# EAGLE schematic Vector_Board_Schematic_v12 (EAGLE 9.7.0)
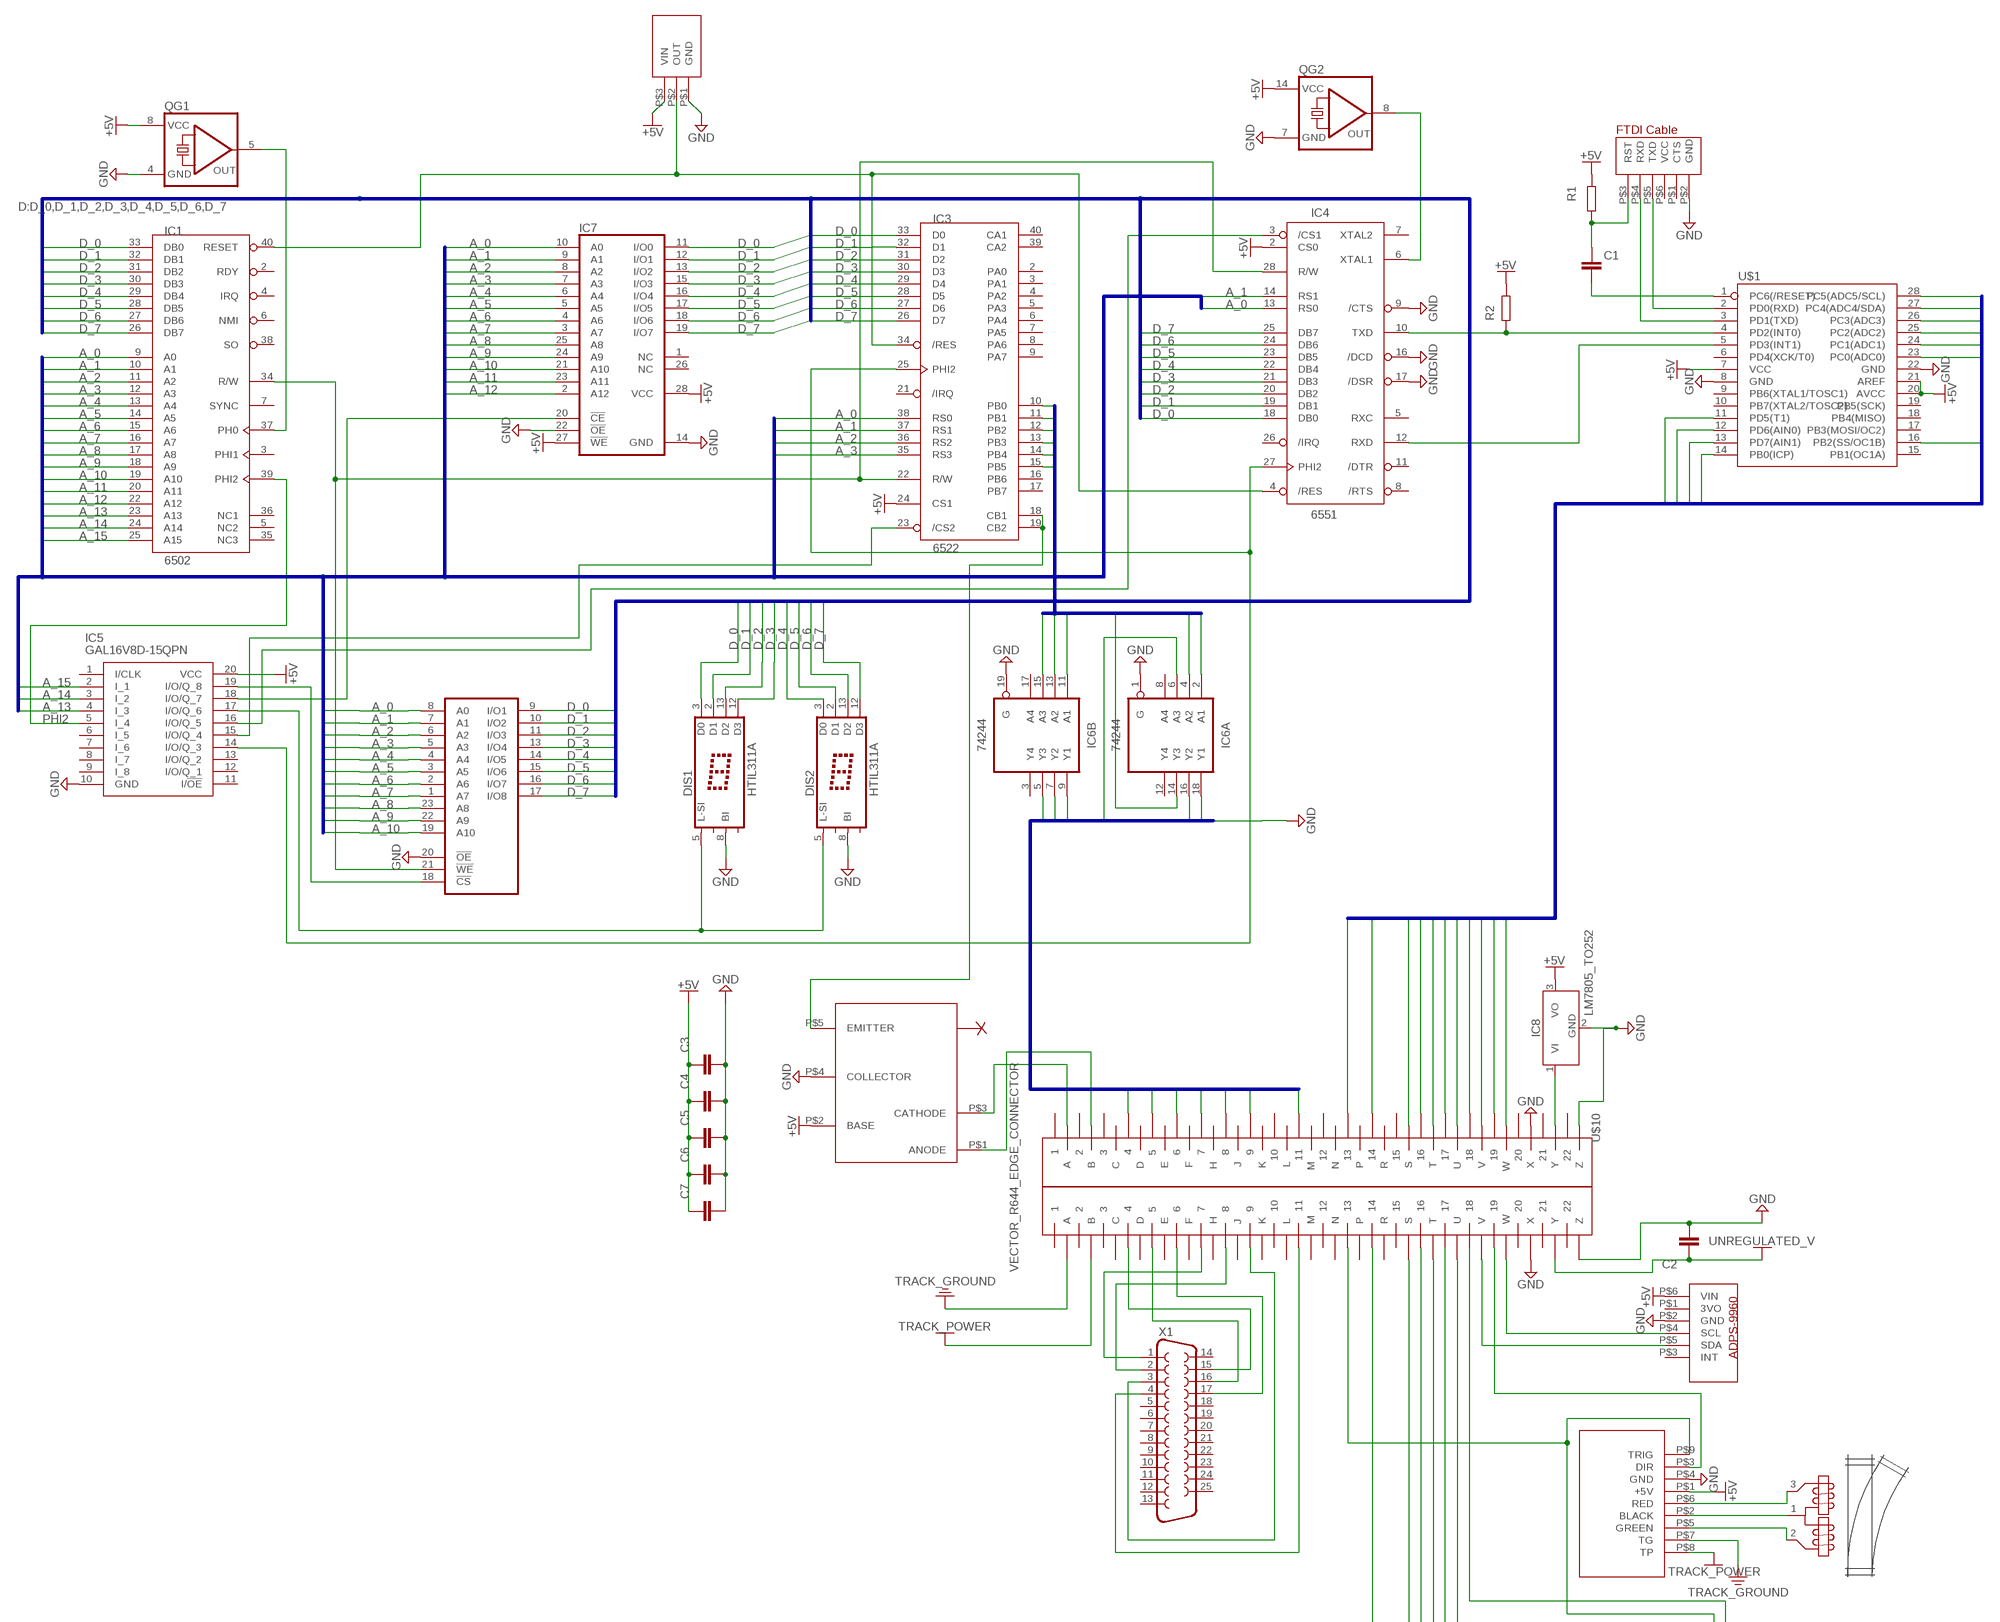
[diagram p0: schematic, sheet 1, part 1 of 2]
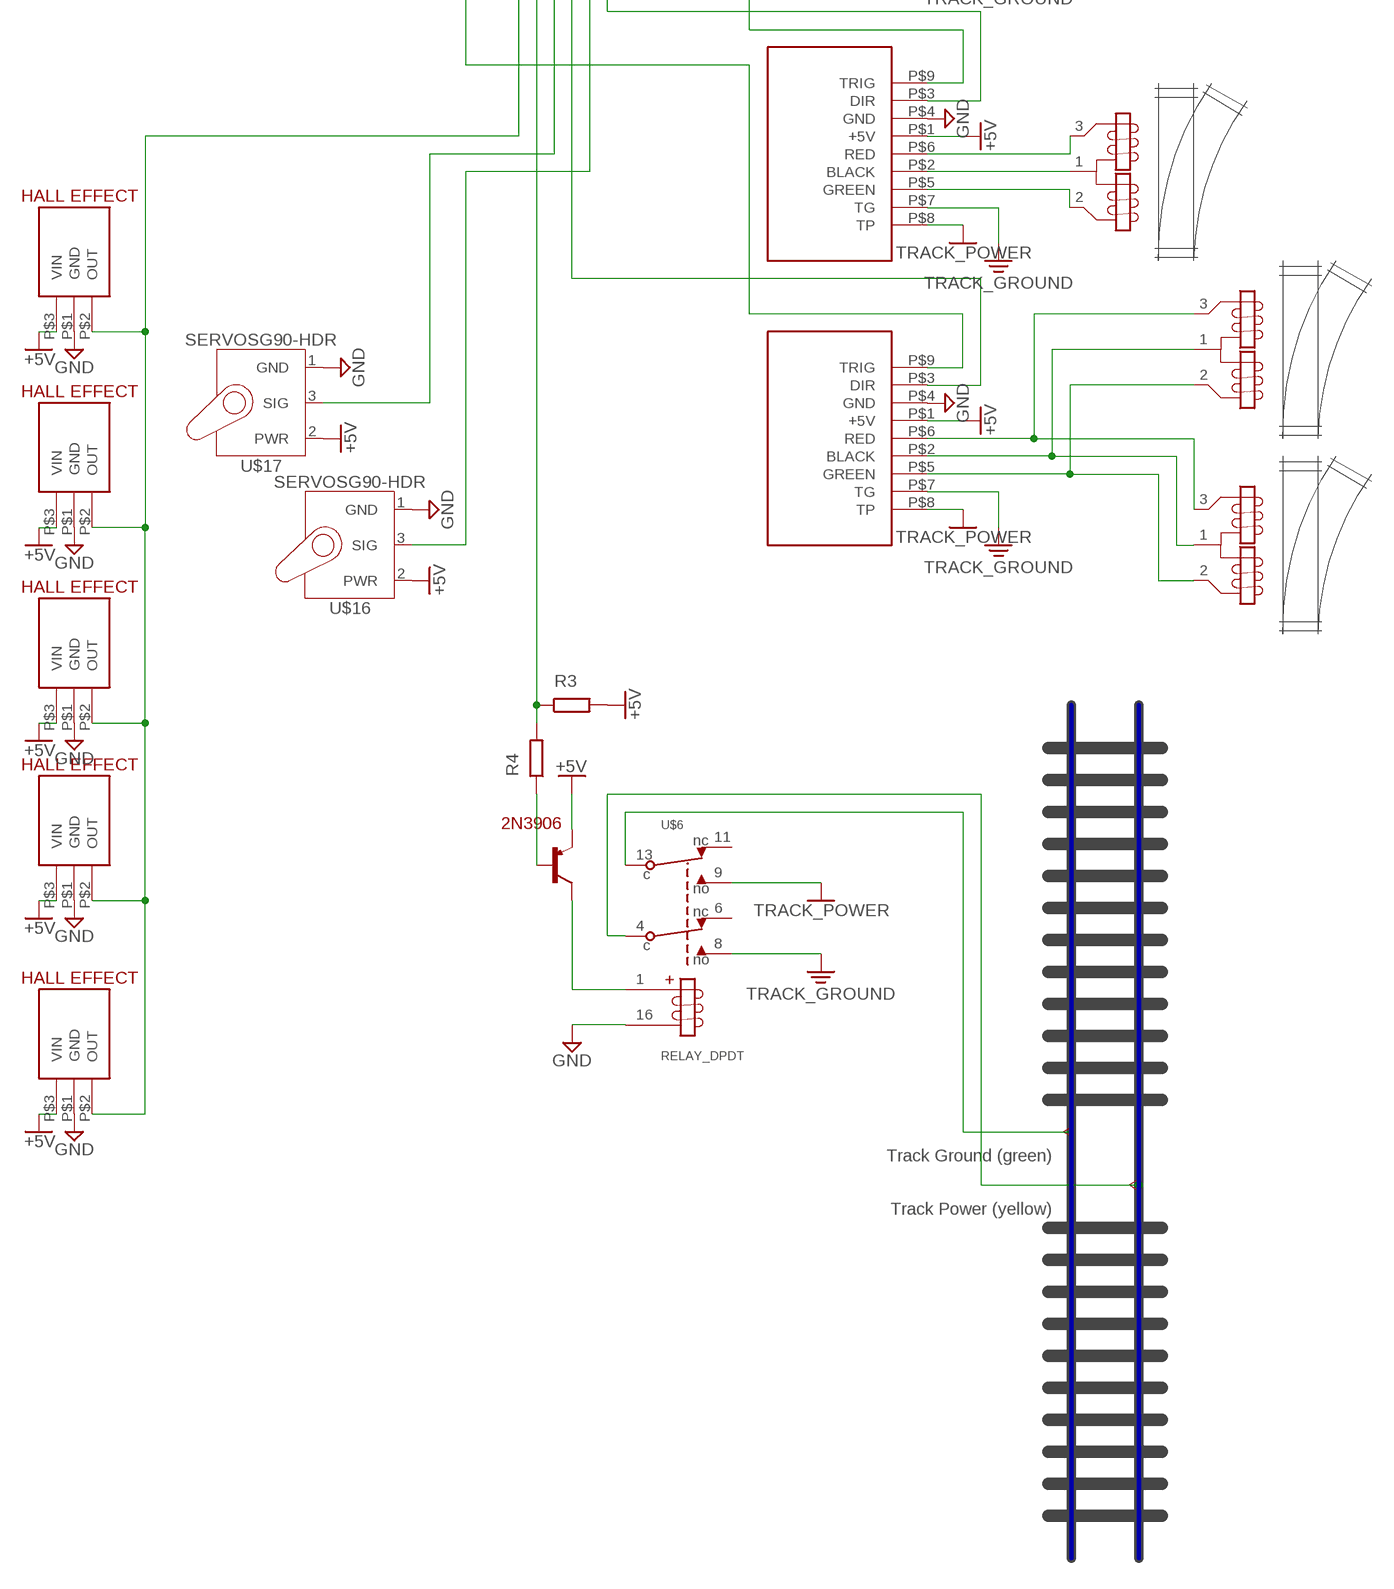
[diagram p1: schematic, sheet 1, part 2 of 2]

## Parts
C1  C  (no package)
C2  C  (no package)
C3  C  (no package)
C4  C  (no package)
C5  C  (no package)
C6  C  (no package)
C7  C  (no package)
DIS1  HTIL311A  [HTIL311A]
DIS2  HTIL311A  [HTIL311A]
IC1  6502  [DIP40]
IC2  6116P  [DIL24-6]
IC3  6522  [DIP40]
IC4  6551  [DIP28]
IC5  GAL16V8D-15QPN  [DIP794W56P254L2591H533Q20N]
IC6  74244  74LS244DW  [SO20W]
IC7  28C64C  [DIL28-6]
IC8  LM7805_TO252  [TO252]
OPTOISOLATOR  OPTO  [OPTO]
QG1  QG5460  [DIL08S]
QG2  QG5860  [DIL14S]
R1  R  (no package)
R2  R  (no package)
R3  R  (no package)
R4  R  (no package)
T1  2N2222  [TO92-EBC-OVAL]
U$1  ATMEGA328-DIP  [DIP28]
U$2  CONNECTOR-REVERSE  [CONNTECTOR-REVERSE]
U$3  FTDI-CABLE  [FTDI-CABLE]
U$4  POWERON-RESET  [RESET]
U$6  RELAY_DPDT  [DIP16_RELAY]
U$7  ADPS-9960  [ADPS-9960]
U$8  ATLASCODE80TRACK  [ATLASCODE80TRACK]
U$9  RR_REMOTE_TURNOUT  [W237-103]
U$10  VECTOR_R644_EDGE_CONNECTOR  [VECTOR44]
U$11  HALL-EFFECT  [HALL-EFFECT]
U$12  HALL-EFFECT  [HALL-EFFECT]
U$13  HALL-EFFECT  [HALL-EFFECT]
U$14  HALL-EFFECT  [HALL-EFFECT]
U$15  HALL-EFFECT  [HALL-EFFECT]
U$16  SERVOSG90-HDR  [1X03]
U$17  SERVOSG90-HDR  [1X03]
U$24  RR_REMOTE_TURNOUT  [W237-103]
U$25  RR_REMOTE_TURNOUT  [W237-103]
U$26  RR_REMOTE_TURNOUT  [W237-103]
U$27  TRICKLE-CHARGE  [TRICKLE-CHARGE]
U$28  TRICKLE-CHARGE  [TRICKLE-CHARGE]
U$29  TRICKLE-CHARGE  [TRICKLE-CHARGE]
X1  F25H  [F25H]

## Nets
4: U$10.P$4 ; supply symbol labelled GND
5: IC6.18(A:Y1) U$10.P$5
6: IC6.16(A:Y2) U$10.P$6
7: IC6.6(A:A3) U$10.P$7
8: IC6.9(B:Y1) U$10.P$8
9: IC6.5(B:Y3) U$10.P$9
11: IC6.7(B:Y2) U$10.P$11
+5V: IC3.24(CS1) IC4.2(CS0) IC5.20(VCC) IC7.27(!WE) IC7.28(VCC) IC8.3(VO) OPTOISOLATOR.P$2(BASE) QG1.8(VCC) QG2.14(VCC) R1.1 R2.2 R3.2 T1.C U$1.7(VCC) U$1.20(AVCC) U$1.21(AREF) U$4.P$3(VIN) U$7.P$6(VIN) U$11.P$3(VIN) U$12.P$3(VIN) U$13.P$3(VIN) U$14.P$3(VIN) U$15.P$3(VIN) U$16.2(PWR) U$17.2(PWR) U$27.P$1(+5V) U$28.P$1(+5V) U$29.P$1(+5V)
A0: U$1.23(PC0(ADC0)) U$10.P$17
A1: U$1.24(PC1(ADC1)) U$10.P$18
A2: U$1.25(PC2(ADC2)) U$10.P$19
A3: U$1.26(PC3(ADC3)) U$10.P$16
A4: U$1.27(PC4(ADC4/SDA)) U$10.P$V(V)
A5: U$1.28(PC5(ADC5/SCL)) U$10.P$W(W)
A_0: IC1.9(A0) IC2.8(A0) IC3.38(RS0) IC4.13(RS0) IC7.10(A0)
A_1: IC1.10(A1) IC2.7(A1) IC3.37(RS1) IC4.14(RS1) IC7.9(A1)
A_2: IC1.11(A2) IC2.6(A2) IC3.36(RS2) IC7.8(A2)
A_3: IC1.12(A3) IC2.5(A3) IC3.35(RS3) IC7.7(A3)
A_4: IC1.13(A4) IC2.4(A4) IC7.6(A4)
A_5: IC1.14(A5) IC2.3(A5) IC7.5(A5)
A_6: IC1.15(A6) IC2.2(A6) IC7.4(A6)
A_7: IC1.16(A7) IC2.1(A7) IC7.3(A7)
A_8: IC1.17(A8) IC2.23(A8) IC7.25(A8)
A_9: IC1.18(A9) IC2.22(A9) IC7.24(A9)
A_10: IC1.19(A10) IC2.19(A10) IC7.21(A10)
A_11: IC1.20(A11) IC7.23(A11)
A_12: IC1.22(A12) IC7.2(A12)
A_13: IC1.23(A13) IC5.4(I_3)
A_14: IC1.24(A14) IC5.3(I_2)
A_15: IC1.25(A15) IC5.2(I_1)
D5: U$1.11(PD5(T1)) U$10.P$U(U)
D6: U$1.12(PD6(AIN0)) U$10.P$T(T)
D7: U$1.13(PD7(AIN1)) U$10.P$13
D8: U$1.14(PB0(ICP)) U$10.P$14
D10: U$1.16(PB2(SS/OC1B)) U$10.P$S(S)
D_0: DIS1.3(D0) IC1.33(DB0) IC2.9(I/O1) IC3.33(D0) IC4.18(DB0) IC7.11(I/O0)
D_1: DIS1.2(D1) IC1.32(DB1) IC2.10(I/O2) IC3.32(D1) IC4.19(DB1) IC7.12(I/O1)
D_2: DIS1.13(D2) IC1.31(DB2) IC2.11(I/O3) IC3.31(D2) IC4.20(DB2) IC7.13(I/O2)
D_3: DIS1.12(D3) IC1.30(DB3) IC2.13(I/O4) IC3.30(D3) IC4.21(DB3) IC7.15(I/O3)
D_4: DIS2.3(D0) IC1.29(DB4) IC2.14(I/O5) IC3.29(D4) IC4.22(DB4) IC7.16(I/O4)
D_5: DIS2.2(D1) IC1.28(DB5) IC2.15(I/O6) IC3.28(D5) IC4.23(DB5) IC7.17(I/O5)
D_6: DIS2.13(D2) IC1.27(DB6) IC2.16(I/O7) IC3.27(D6) IC4.24(DB6) IC7.18(I/O6)
D_7: DIS2.12(D3) IC1.26(DB7) IC2.17(I/O8) IC3.26(D7) IC4.25(DB7) IC7.19(I/O7)
GND: C2.2 DIS1.8(BI) DIS2.8(BI) IC2.20(!OE) IC4.9(/CTS) IC4.16(/DCD) IC4.17(/DSR) IC5.10(GND) IC6.1(A:G) IC6.19(B:G) IC7.14(GND) IC7.22(!OE) IC8.2(GND) OPTOISOLATOR.P$4(COLLECTOR) QG1.4(GND) QG2.7(GND) U$1.8(GND) U$1.22(GND) U$2.P$36(X) U$2.P$38(Z) U$3.P$2(GND) U$4.P$1(GND) U$6.16 U$7.P$2(GND) U$10.P$X(X) U$10.P$Z(Z) U$11.P$1(GND) U$12.P$1(GND) U$13.P$1(GND) U$14.P$1(GND) U$15.P$1(GND) U$16.1(GND) U$17.1(GND) U$27.P$4(GND) U$28.P$4(GND) U$29.P$4(GND)
N$1: IC1.37(PH0) QG1.5(OUT)
N$2: IC4.6(XTAL1) QG2.8(OUT)
N$3: IC4.3(/CS1) IC5.16(I/O/Q_5)
N$4: IC2.18(!CS) IC5.19(I/O/Q_8)
N$5: IC5.18(I/O/Q_7) IC7.20(!CE)
N$6: DIS1.5(L-SI) DIS2.5(L-SI) IC5.17(I/O/Q_6)
N$7: IC3.23(/CS2) IC5.15(I/O/Q_4)
N$8: IC3.25(PHI2) IC4.27(PHI2) IC5.14(I/O/Q_3)
N$9: U$2.P$4 X1.15
N$10: U$2.P$6 X1.17
N$11: IC1.34(R/W) IC2.21(!WE) IC3.22(R/W) IC4.28(R/W)
N$12: U$2.P$5 X1.16
N$13: U$2.P$7 X1.1
N$14: IC4.10(TXD) R2.1 U$1.4(PD2(INT0))
N$15: IC4.12(RXD) U$1.5(PD3(INT1))
N$16: C1.2 U$1.1(PC6(/RESET))
N$17: C1.1 R1.2 U$3.P$3(RST)
N$18: U$1.3(PD1(TXD)) U$3.P$4(RXD)
N$19: U$1.2(PD0(RXD)) U$3.P$5(TXD)
N$20: U$2.P$33(U) U$16.3(SIG)
N$21: U$2.P$32(T) U$17.3(SIG)
N$22: U$2.P$14 U$29.P$9(TRIG)
N$23: U$2.P$13 U$27.P$9(TRIG) U$28.P$9(TRIG)
N$24: OPTOISOLATOR.P$1(ANODE) U$10.P$B(B)
N$25: OPTOISOLATOR.P$3(CATHODE) U$10.P$A(A)
N$26: U$2.P$31(S) U$11.P$2(OUT) U$12.P$2(OUT) U$13.P$2(OUT) U$14.P$2(OUT) U$15.P$2(OUT)
N$27: IC3.18(CB1) IC3.19(CB2) OPTOISOLATOR.P$5(EMITTER)
N$28: C3.2 C4.2 C5.2 C6.2 C7.2 ; supply symbol labelled GND
N$29: C3.1 C4.1 C5.1 C6.1 C7.1 ; supply symbol labelled +5V
N$30: IC1.40(RESET) IC3.34(/RES) IC4.4(/RES) U$4.P$2(OUT)
N$41: R4.1 T1.B
N$42: T1.E U$6.1
N$43: U$6.P2 U$8.P$2
N$44: U$2.P$8 X1.2
N$45: U$2.P$9 X1.3
N$46: U$2.P$11 X1.4
N$48: IC8.1(VI) U$10.P$Y(Y)
N$51: U$2.P$35(W) U$7.P$4(SCL)
N$52: U$2.P$34(V) U$7.P$5(SDA)
N$53: U$2.P$19 U$27.P$3(DIR)
N$54: R3.1 R4.2 U$2.P$16
N$55: U$6.P1 U$8.P$1
N$57: U$2.P$18 U$28.P$3(DIR)
N$58: U$2.P$17 U$29.P$3(DIR)
N$59: U$9.1 U$27.P$2(BLACK)
N$60: U$9.3 U$27.P$6(RED)
N$61: U$9.2 U$27.P$5(GREEN)
N$62: U$24.3 U$28.P$6(RED)
N$63: U$24.1 U$28.P$2(BLACK)
N$64: U$24.2 U$28.P$5(GREEN)
N$65: U$25.3 U$26.3 U$29.P$6(RED)
N$66: U$25.1 U$26.1 U$29.P$2(BLACK)
N$67: U$25.2 U$26.2 U$29.P$5(GREEN)
PB0: IC3.10(PB0) IC6.2(A:A1)
PB1: IC3.11(PB1) IC6.4(A:A2)
PB2: IC3.12(PB2) IC6.14(A:Y3)
PB3: IC3.13(PB3) IC6.11(B:A1)
PB4: IC3.14(PB4) IC6.13(B:A2)
PB5: IC3.15(PB5) IC6.15(B:A3)
PHI2: IC1.39(PHI2) IC5.5(I_4)
TRACK_GROUND: U$2.P$23(A) U$6.S1 U$27.P$7(TG) U$28.P$7(TG) U$29.P$7(TG)
TRACK_POWER: U$2.P$24(B) U$6.S2 U$27.P$8(TP) U$28.P$8(TP) U$29.P$8(TP)
UNREGULATED_V: C2.1 U$2.P$37(Y)
Unconnected: DIS1.1(LEDSUP) DIS2.1(LEDSUP) IC1.2(RDY) IC1.3(PHI1) IC1.4(IRQ) IC1.5(NC2) IC1.6(NMI) IC1.7(SYNC) IC1.35(NC3) IC1.36(NC1) IC1.38(SO) IC3.2(PA0) IC3.3(PA1) IC3.4(PA2) IC3.5(PA3) IC3.6(PA4) IC3.7(PA5) IC3.8(PA6) IC3.9(PA7) IC3.16(PB6) IC3.17(PB7) IC3.21(/IRQ) IC3.39(CA2) IC3.40(CA1) IC4.5(RXC) IC4.7(XTAL2) IC4.8(/RTS) IC4.11(/DTR) IC4.26(/IRQ) IC5.1(I/CLK) IC5.6(I_5) IC5.7(I_6) IC5.8(I_7) IC5.9(I_8) IC5.11(I/!OE) IC5.12(I/O/Q_1) IC5.13(I/O/Q_2) IC6.3(B:Y4) IC6.8(A:A4) IC6.12(A:Y4) IC6.17(B:A4) IC7.1(NC) IC7.26(NC) U$1.6(PD4(XCK/T0)) U$1.9(PB6(XTAL1/TOSC1)) U$1.10(PB7(XTAL2/TOSC2)) U$1.15(PB1(OC1A)) U$1.17(PB3(MOSI/OC2)) U$1.18(PB4(MISO)) U$1.19(PB5(SCK)) U$2.P$1 U$2.P$2 U$2.P$3 U$2.P$10 U$2.P$12 U$2.P$15 U$2.P$20 U$2.P$21 U$2.P$22 U$2.P$25(C) U$2.P$26(D) U$2.P$27(M) U$2.P$28(N) U$2.P$29(P) U$2.P$30(R) U$2.P$39(L) U$2.P$40(K) U$2.P$41(J) U$2.P$42(H) U$2.P$43(F) U$2.P$44(E) U$3.P$1(CTS) U$3.P$6(VCC) U$6.O1 U$6.O2 U$7.P$1(3VO) U$7.P$3(INT) U$10.P$1 U$10.P$2 U$10.P$3 U$10.P$10 U$10.P$12 U$10.P$15 U$10.P$20 U$10.P$21 U$10.P$22 U$10.P$C(C) U$10.P$D(D) U$10.P$E(E) U$10.P$F(F) U$10.P$H(H) U$10.P$J(J) U$10.P$K(K) U$10.P$L(L) U$10.P$M(M) U$10.P$N(N) U$10.P$P(P) U$10.P$R(R) X1.5 X1.6 X1.7 X1.8 X1.9 X1.10 X1.11 X1.12 X1.13 X1.14 X1.18 X1.19 X1.20 X1.21 X1.22 X1.23 X1.24 X1.25

## Buses
D:D_0,D_1,D_2,D_3,D_4,D_5,D_6,D_7
A:A_0,A_1,A_2,A_3,A_4,A_5,A_6,A_7,A_8,A_9,A_10,A_11,A_12,A_13,A_14,A_15
PB[0..5]
4,5,6,7,8,9,11
A[0..5],D[0..13]

## Power pins joined to a net without a drawn wire
GND: DIS1.7(GND) DIS2.7(GND) IC1.1(GND) IC1.21(GND) IC2.12(GND) IC3.1(GND) IC4.1(GND) IC6.10(GND)
VCC: DIS1.14(VCC) DIS2.14(VCC) IC1.8(VCC) IC2.24(VCC) IC3.20(VCC) IC4.15(VCC) IC6.20(VCC)

## Library data of the parts
C1-C7 = ngspice-simulation:C: CAPACITOR
DIS1 DIS2 = JDP_created_v7:HTIL311A: LED DISPLAY 1-character dot matrix, 2 decimal points Internal TTL MSI IC with Latch, Decoder, and Driver Source: http://www.taosinc.com .. til311-e6.pdf
IC1 = MAE412_JDP:6502: 6502 processor
IC2 = MAE412_JDP:6116P: MEMORY; OC_FARNELL: unknown; OC_NEWARK: unknown
IC3 = MAE412_JDP:6522: I/O device: two 8-bits ports, handshake lines, timers.
IC4 = MAE412_JDP:6551: ACIA. Capable of RS-232
IC5 = GAL16V8D-15QPN:GAL16V8D-15QPN: SPLD - Simple Programmable Logic Devices 16 Input 8 Output 5V 1/4 Power 15ns Source: Datasheet <https://media.digikey.com/pdf/Data Sheets/Lattice PDFs/GAL16V8.pdf>; DESCRIPTION: SPLD - Simple Programmable Logic Devices 16 Input 8 Output 5V 1/4 Power 15ns; HEIGHT: 5.334mm; MANUFACTURER_NAME: Lattice Semiconductor; MANUFACTURER_PART_NUMBER: GAL16V8D-15QPN; MOUSER_PART_NUMBER: 842-GAL16V8D15QPN; MOUSER_PRICE-STOCK: https://www.mouser.co.uk/ProductDetail/Lattice/GAL16V8D-15QPN?qs=SKRcP3y%252BHgMQs0cq%2FH5yfA%3D%3D
IC6 = IC_Logic:74*244: Octal BUFFER and LINE DRIVER, 3-state; CATEGORY: IC_Logic; SUB-CATEGORY: Buffer
IC7 = MAE412_JDP:28C64C: MEMORY; MPN: AT28C64B-15PU; OC_FARNELL: 1095784; OC_NEWARK: 96K6557
IC8 = Tinkercad:LM7805: 5V Voltage Regulator Reference Datasheet <https://www.ti.com/lit/ds/symlink/lm340.pdf>
OPTOISOLATOR = Custom Electronics Library:OPTO
QG1 = MAE412_JDP:QG5460: CRYSTAL RESONATOR; OC_FARNELL: unknown; OC_NEWARK: unknown
QG2 = MAE412_JDP:QG5860: CRYSTAL RESONATOR; OC_FARNELL: unknown; OC_NEWARK: unknown
R1-R4 = ngspice-simulation:R: RESISTOR
T1 = Custom Electronics Library:2N2222: NPN TRANSISTOR Big oval pads
U$1 = JDP_created_v7:ATMEGA328-DIP
U$2 = Custom Electronics Library:CONNECTOR-REVERSE
U$3 = Custom Electronics Library:FTDI-CABLE
U$4 = Custom Electronics Library:POWERON-RESET
U$6 = JDP_created_v7:RELAY_DPDT
U$7 = Custom Electronics Library:ADPS-9960
U$8 = JDP_created_v7:ATLASCODE80TRACK
U$9 U$24-U$26 = JDP_created_v7:RR_REMOTE_TURNOUT
U$10 = JDP_created_v7:VECTOR_R644_EDGE_CONNECTOR
U$11-U$15 = Custom Electronics Library:HALL-EFFECT
U$16 U$17 = Tinkercad:SERVO
U$27-U$29 = Custom Electronics Library:TRICKLE-CHARGE
X1 = con-subd:F25: SUB-D; OC_FARNELL: unknown; OC_NEWARK: unknown